# Altium schematic sheet Power-Supplies.SchDoc: Payload Card 5V Rail Power Supplies
size A2; Revision: 1A; SheetNumber: 1; SheetTotal: 3; Organization: Brickworks; Address1: Matthew Glazer; Address2: Design Engineer
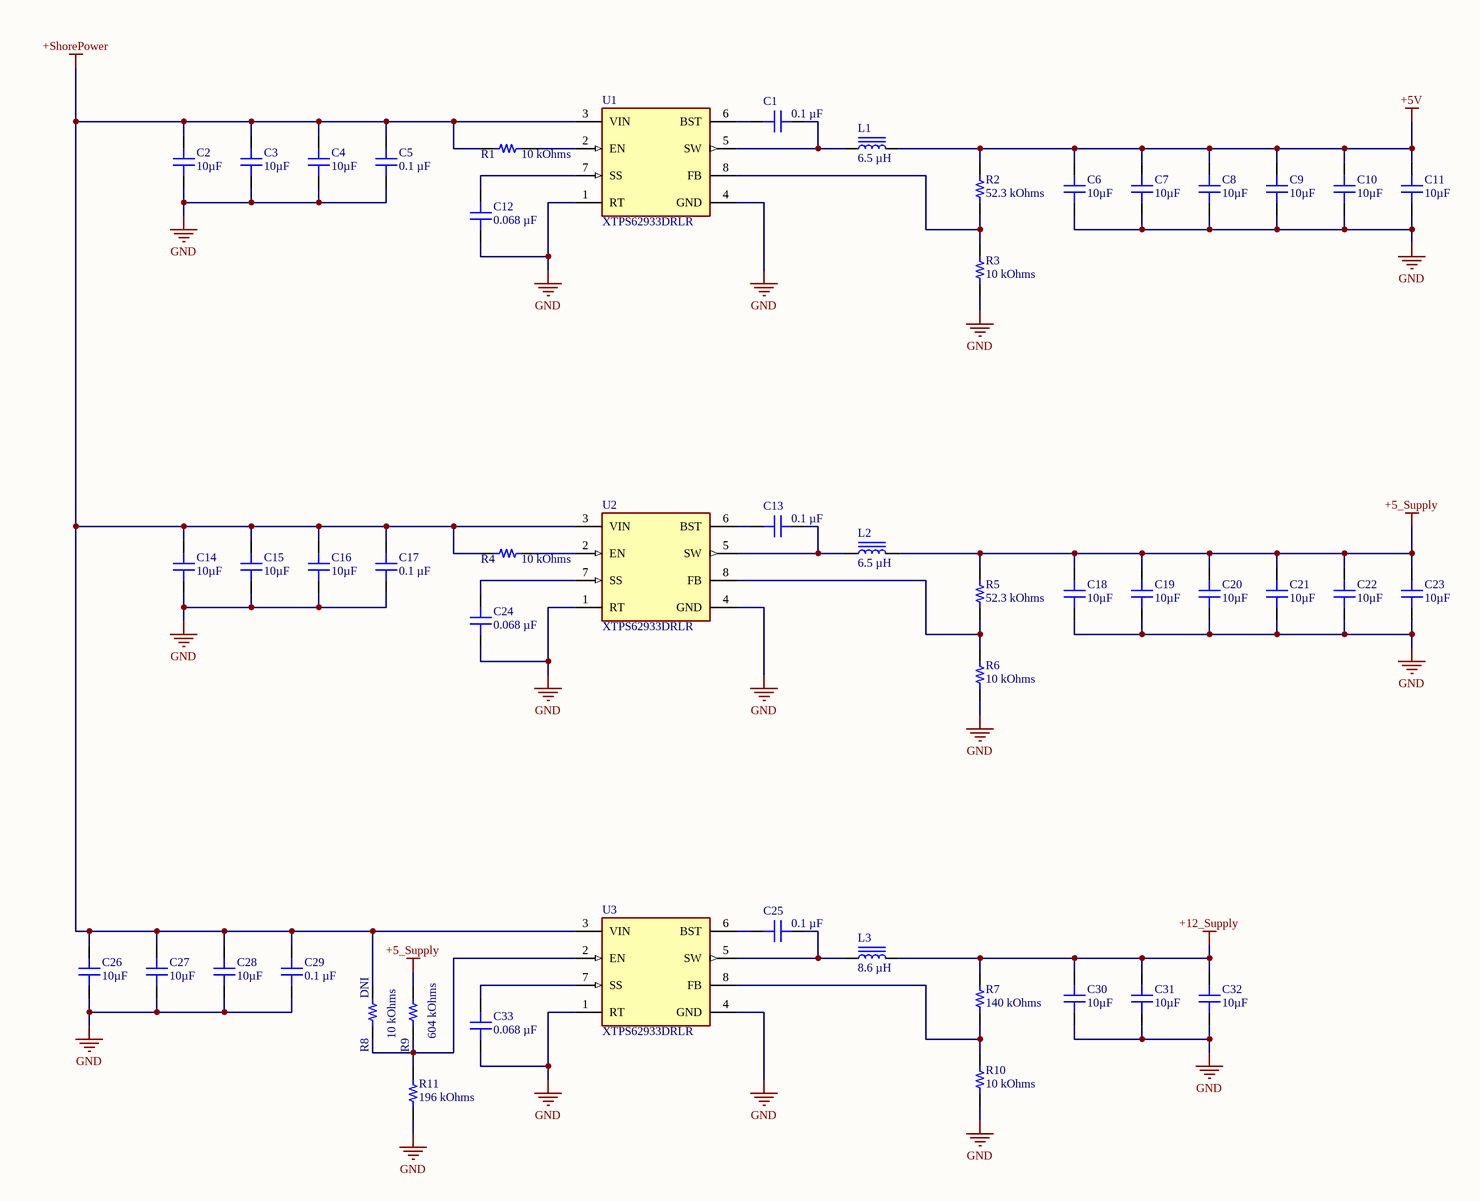
[diagram p0: Power-Supplies.SchDoc]

## Parts
C1  0.1 µF  [CAP 0603_1608]
C2  10µF  [CAP 0805_2012]
C3  10µF  [CAP 0805_2012]
C4  10µF  [CAP 0805_2012]
C5  0.1 µF  [CAP 0603_1608]
C6  10µF  [CAP 0805_2012]
C7  10µF  [CAP 0805_2012]
C8  10µF  [CAP 0805_2012]
C9  10µF  [CAP 0805_2012]
C10  10µF  [CAP 0805_2012]
C11  10µF  [CAP 0805_2012]
C12  0.068 µF  [CAP 0603_1608]
C13  0.1 µF  [CAP 0603_1608]
C14  10µF  [CAP 0805_2012]
C15  10µF  [CAP 0805_2012]
C16  10µF  [CAP 0805_2012]
C17  0.1 µF  [CAP 0603_1608]
C18  10µF  [CAP 0805_2012]
C19  10µF  [CAP 0805_2012]
C20  10µF  [CAP 0805_2012]
C21  10µF  [CAP 0805_2012]
C22  10µF  [CAP 0805_2012]
C23  10µF  [CAP 0805_2012]
C24  0.068 µF  [CAP 0603_1608]
C25  0.1 µF  [CAP 0603_1608]
C26  10µF  [CAP 0805_2012]
C27  10µF  [CAP 0805_2012]
C28  10µF  [CAP 0805_2012]
C29  0.1 µF  [CAP 0603_1608]
C30  10µF  [CAP 0805_2012]
C31  10µF  [CAP 0805_2012]
C32  10µF  [CAP 0805_2012]
C33  0.068 µF  [CAP 0603_1608]
L1  6.5 µH  [TAIYO YUDEN NR1005]
L2  6.5 µH  [TAIYO YUDEN NR1005]
L3  8.6 µH  [BOURNS SRR6028]
R1  10 kOhms  [RES 0603_1608]
R2  52.3 kOhms  [RES 0603_1608]
R3  10 kOhms  [RES 0603_1608]
R4  10 kOhms  [RES 0603_1608]
R5  52.3 kOhms  [RES 0603_1608]
R6  10 kOhms  [RES 0603_1608]
R7  140 kOhms  [RES 0603_1608]
R8  10 kOhms  [RES 0603_1608]
R9  604 kOhms  [RES 0603_1608]
R10  10 kOhms  [RES 0603_1608]
R11  196 kOhms  [RES 0603_1608]
U1  XTPS62933DRLR  [FP-DRL0008A-MFG]
U2  XTPS62933DRLR  [FP-DRL0008A-MFG]
U3  XTPS62933DRLR  [FP-DRL0008A-MFG]

## Nets
+5_Supply: C18.2 C19.2 C20.2 C21.2 C22.2 C23.2 L2.2 R5.2 R9.2
+5V: C6.2 C7.2 C8.2 C9.2 C10.2 C11.2 L1.2 R2.2
+12_Supply: C30.2 C31.2 C32.2 L3.2 R7.2
+ShorePower: C2.2 C3.2 C4.2 C5.1 C14.2 C15.2 C16.2 C17.1 C26.2 C27.2 C28.2 C29.1 R1.1 R4.1 R8.2 U1.3(VIN) U2.3(VIN) U3.3(VIN)
GND: C2.1 C3.1 C4.1 C5.2 C6.1 C7.1 C8.1 C9.1 C10.1 C11.1 C12.1 C14.1 C15.1 C16.1 C17.2 C18.1 C19.1 C20.1 C21.1 C22.1 C23.1 C24.1 C26.1 C27.1 C28.1 C29.2 C30.1 C31.1 C32.1 C33.1 R3.1 R6.1 R10.1 R11.1 U1.1(RT) U1.4(GND) U2.1(RT) U2.4(GND) U3.1(RT) U3.4(GND)
NetC1_1: C1.1 L1.1 U1.5(SW)
NetC1_2: C1.2 U1.6(BST)
NetC12_2: C12.2 U1.7(SS)
NetC13_1: C13.1 L2.1 U2.5(SW)
NetC13_2: C13.2 U2.6(BST)
NetC24_2: C24.2 U2.7(SS)
NetC25_1: C25.1 L3.1 U3.5(SW)
NetC25_2: C25.2 U3.6(BST)
NetC33_2: C33.2 U3.7(SS)
NetR1_2: R1.2 U1.2(EN)
NetR2_1: R2.1 R3.2 U1.8(FB)
NetR4_2: R4.2 U2.2(EN)
NetR5_1: R5.1 R6.2 U2.8(FB)
NetR7_1: R7.1 R10.2 U3.8(FB)
NetR8_1: R8.1 R9.1 R11.2 U3.2(EN)

## Notes on the sheet
- (near R8) DNI
- Title
- Size:
- Date:
- File:
- A2
- Number:
- Time:
- Revision:
- Sheet
- of

## Library data of the parts
C1 C5 C13 C17 C25 C29 = CL10B104KB8NNWC: CAP CER 0.1UF 50V X7R 0603; manufacturer: Samsung Electro-Mechanics; Tolerance: ±10%; Part Number: CL10B104KB8NNWC; Value: 0.1 µF; Applications: General Purpose; Capacitance: 0.1 µF; componentlink1description: Datasheet; componentlink1url: http://www.samsungsem.com/kr/support/product-search/mlcc/CL10B104KB8NNWC.jsp; componentlink2description: DigiKey Link; componentlink2url: https://www.digikey.com/en/products/detail/samsung-electro-mechanics/CL10B104KB8NNWC/3887593; Device Package: 0603 (1608 Metric); lastupdated: 3/8/2022 9:16:52 PM; Lifecycle Status: Active; Minimum Order: 1; Mounting Type: Surface Mount, MLCC; Operating Temperature: -55°C ~ 125°C; Package / Case: 0603 (1608 Metric); packaging: CutTape; partid: 16078; Part Status: Active; price: 0.01; series: CL; Size / Dimension: 0.063" L x 0.031" W (1.60mm x 0.80mm); Supplier 1: DigiKey; Supplier Part Number 1: 1276-1935-1-ND; Temperature Coefficient: X7R; Thickness (Max): 0.035" (0.90mm); Voltage - Rated: 50V
C2-C4 C6-C11 C14-C16 C18-C23 C26-C28 C30-C32 = CC0805KKX5R7BB106: CAP CER 10UF 16V X5R 0805; Manufacturer: Yageo; Tolerance: ±10%; Part Number: CC0805KKX5R7BB106; Value: 10µF; Applications: General Purpose; Capacitance: 10µF; ComponentLink1Description: Datasheet; ComponentLink1URL: https://www.yageo.com/upload/media/product/productsearch/datasheet/mlcc/UPY-GPHC_X5R_4V-to-50V_25.pdf; ComponentLink2Description: DigiKey Link; ComponentLink2URL: http://digikey.com/product-detail/en/yageo/CC0805KKX5R7BB106/311-1865-1-ND/5195767; Device Package: 0805 (2012 Metric); LastUpdated: 9/2/2020 1:04:30 AM; Lifecycle Status: Active; Minimum Order: 1; Mounting Type: Surface Mount, MLCC; Operating Temperature: -55°C ~ 85°C; Package / Case: 0805 (2012 Metric); Packaging: TapeAndReel; PartId: 8867; Part Status: Active; Price: 0.09; Series: CC; Size / Dimension: 0.079" L x 0.049" W (2.00mm x 1.25mm); Supplier 1: DigiKey; Supplier Part Number 1: 311-1865-1-ND; Temperature Coefficient: X5R; Thickness (Max): 0.057" (1.45mm); Voltage - Rated: 16V
C12 C24 C33 = CC0603KRX7R8BB683: CAP CER 0.068UF 25V X7R 0603; manufacturer: Yageo; Tolerance: ±10%; Part Number: CC0603KRX7R8BB683; Value: 0.068 µF; Applications: General Purpose; Capacitance: 0.068 µF; componentlink1description: Datasheet; componentlink1url: https://www.yageo.com/upload/media/product/productsearch/datasheet/mlcc/UPY-GPHC_X7R_6.3V-to-50V_18.pdf; componentlink2description: DigiKey Link; componentlink2url: https://www.digikey.com/en/products/detail/yageo/CC0603KRX7R8BB683/5883792; Device Package: 0603 (1608 Metric); lastupdated: 3/17/2022 8:26:41 AM; Lifecycle Status: Active; Minimum Order: 1; Mounting Type: Surface Mount, MLCC; Operating Temperature: -55°C ~ 125°C; Package / Case: 0603 (1608 Metric); packaging: TapeAndReel; partid: 13821; Part Status: Active; price: 0.01; series: CC; Size / Dimension: 0.063" L x 0.031" W (1.60mm x 0.80mm); Supplier 1: DigiKey; Supplier Part Number 1: 311-4091-1-ND; Temperature Coefficient: X7R; Thickness (Max): 0.035" (0.90mm); Voltage - Rated: 25V
L1 L2 = NR10050T6R5N: FIXED IND 6.5UH 5.2A 23.4MOHM SM; Manufacturer: Taiyo Yuden; Current - Saturation: 6A; DC Resistance (DCR): 23.4mOhm Max; Frequency - Self Resonant: 19MHz; Inductance Frequency - Test: 100 kHz; Material - Core: Ferrite; Shielding: Shielded; Tolerance: ±30%; Type: Wirewound; Part Number: NR10050T6R5N; ComponentLink1Description: Datasheet; ComponentLink1URL: https://ds.yuden.co.jp/TYCOMPAS/ut/detail?pn=NR10050T6R5N  &u=M; ComponentLink2Description: DigiKey Link; ComponentLink2URL: https://www.digikey.com/en/products/detail/taiyo-yuden/NR10050T6R5N/1007971; Current Rating (Amps): 5.2 A; Device Package: Nonstandard; Height - Seated (Max): 0.197" (5.00mm); Inductance: 6.5 µH; LastUpdated: 3/17/2022 9:14:25 AM; Lifecycle Status: Active; Minimum Order: 1; Mounting Type: Surface Mount; Operating Temperature: -25°C ~ 105°C; Package / Case: Nonstandard; Packaging: TapeAndReel; PartId: 3626; Part Status: Active; Price: 0.51; Series: NR; Size / Dimension: 0.394" L x 0.386" W (10.00mm x 9.80mm); Supplier 1: DigiKey; Supplier Part Number 1: 587-1697-1-ND; Value: 6.5 µH
L3 = SRR6028-8R6Y: FIXED IND 8.6UH 2.1A 56 MOHM SMD; Manufacturer: Bourns Inc.; Current - Saturation: 1.82A; DC Resistance (DCR): 56mOhm Max; Frequency - Self Resonant: 28MHz; Inductance Frequency - Test: 100 kHz; Material - Core: Ferrite; Q @ Freq: 8 @ 2.52MHz; Shielding: Shielded; Tolerance: ±30%; Type: Wirewound; Part Number: SRR6028-8R6Y; ComponentLink1Description: Datasheet; ComponentLink1URL: https://www.bourns.com/docs/Product-Datasheets/SRR6028.pdf; ComponentLink2Description: DigiKey Link; ComponentLink2URL: https://www.digikey.com/en/products/detail/bourns-inc/SRR6028-8R6Y/1970374; Current Rating (Amps): 2.1 A; Device Package: Nonstandard; Height - Seated (Max): 0.118" (3.00mm); Inductance: 8.6 µH; LastUpdated: 3/17/2022 9:03:42 AM; Lifecycle Status: Active; Minimum Order: 1; Mounting Type: Surface Mount; Operating Temperature: -40°C ~ 125°C; Package / Case: Nonstandard; Packaging: TapeAndReel; PartId: 46; Part Status: Active; Price: 0.45; Series: SRR6028; Size / Dimension: 0.268" L x 0.268" W (6.80mm x 6.80mm); Supplier 1: DigiKey; Supplier Part Number 1: SRR6028-8R6YCT-ND; Value: 8.6 µH
R1 R3 R4 R6 R8 R10 = RMCF0603JT10K0: RES 10K OHM 5% 1/10W 0603; Manufacturer: Stackpole Electronics Inc; Power (Watts): 0.1W, 1/10W; Temperature Coefficient: ±200ppm/°C; Part Number: RMCF0603JT10K0; Value: 10 kOhms; ComponentLink1Description: Datasheet; ComponentLink1URL: https://www.seielect.com/catalog/sei-packaging.pdf; ComponentLink2Description: DigiKey Link; ComponentLink2URL: http://digikey.com/product-detail/en/stackpole-electronics-inc/RMCF0603JT10K0/RMCF0603JT10K0CT-ND/1943191; Composition: Thick Film; Device Package: 0603 (1608 Metric); Features: Automotive AEC-Q200; Height - Seated (Max): 0.022" (0.55mm); LastUpdated: 8/30/2020 8:48:45 PM; Lifecycle Status: Active; Minimum Order: 1; Number of Terminations: 2; Operating Temperature: -55°C ~ 155°C; Package / Case: 0603 (1608 Metric); Packaging: CutTape; PartId: 25659; Part Status: Active; Price: 0.10; Ratings: AEC-Q200; Resistance: 10 kOhms; Series: RMCF; Size / Dimension: 0.061" L x 0.031" W (1.55mm x 0.80mm); Supplier 1: DigiKey; Supplier Part Number 1: RMCF0603JT10K0CT-ND; Supplier Device Package: 0603; Tolerance: ±5%
R2 R5 = RMCF0603FT52K3: RES 52.3K OHM 1% 1/10W 0603; Manufacturer: Stackpole Electronics Inc; Power (Watts): 0.1W, 1/10W; Temperature Coefficient: ±100ppm/°C; Part Number: RMCF0603FT52K3; Value: 52.3 kOhms; ComponentLink1Description: Datasheet; ComponentLink1URL: https://www.seielect.com/catalog/sei-rmcf_rmcp.pdf; ComponentLink2Description: DigiKey Link; ComponentLink2URL: https://www.digikey.com/en/products/detail/stackpole-electronics-inc/RMCF0603FT52K3/1714113; Composition: Thick Film; Device Package: 0603 (1608 Metric); Features: Automotive AEC-Q200; Height - Seated (Max): 0.022" (0.55mm); LastUpdated: 3/17/2022 8:41:15 AM; Lifecycle Status: Active; Minimum Order: 1; Number of Terminations: 2; Operating Temperature: -55°C ~ 155°C; Package / Case: 0603 (1608 Metric); Packaging: CutTape; PartId: 26555; Part Status: Active; Price: 0.01; Ratings: AEC-Q200; Resistance: 52.3 kOhms; Series: RMCF; Size / Dimension: 0.061" L x 0.031" W (1.55mm x 0.80mm); Supplier 1: DigiKey; Supplier Part Number 1: RMCF0603FT52K3CT-ND; Supplier Device Package: 0603; Tolerance: ±1%
R7 = RMCF0603FT140K: RES 140K OHM 1% 1/10W 0603; Manufacturer: Stackpole Electronics Inc; Power (Watts): 0.1W, 1/10W; Temperature Coefficient: ±100ppm/°C; Part Number: RMCF0603FT140K; Value: 140 kOhms; ComponentLink1Description: Datasheet; ComponentLink1URL: https://www.seielect.com/catalog/sei-packaging.pdf; ComponentLink2Description: DigiKey Link; ComponentLink2URL: https://www.digikey.com/en/products/detail/stackpole-electronics-inc/RMCF0603FT140K/1761303; Composition: Thick Film; Device Package: 0603 (1608 Metric); Features: Automotive AEC-Q200; Height - Seated (Max): 0.022" (0.55mm); LastUpdated: 3/17/2022 8:42:10 AM; Lifecycle Status: Active; Minimum Order: 1; Number of Terminations: 2; Operating Temperature: -55°C ~ 155°C; Package / Case: 0603 (1608 Metric); Packaging: CutTape; PartId: 10763; Part Status: Active; Price: 0.01; Ratings: AEC-Q200; Resistance: 140 kOhms; Series: RMCF; Size / Dimension: 0.061" L x 0.031" W (1.55mm x 0.80mm); Supplier 1: DigiKey; Supplier Part Number 1: RMCF0603FT140KCT-ND; Supplier Device Package: 0603; Tolerance: ±1%
R9 = RMCF0603FT604K: RES 604K OHM 1% 1/10W 0603; Manufacturer: Stackpole Electronics Inc; Power (Watts): 0.1W, 1/10W; Temperature Coefficient: ±100ppm/°C; Part Number: RMCF0603FT604K; Value: 604 kOhms; ComponentLink1Description: Datasheet; ComponentLink1URL: https://www.seielect.com/catalog/sei-packaging.pdf; ComponentLink2Description: DigiKey Link; ComponentLink2URL: https://www.digikey.com/en/products/detail/stackpole-electronics-inc/RMCF0603FT604K/1714165; Composition: Thick Film; Device Package: 0603 (1608 Metric); Features: Automotive AEC-Q200; Height - Seated (Max): 0.022" (0.55mm); LastUpdated: 3/17/2022 8:41:50 AM; Lifecycle Status: Active; Minimum Order: 1; Number of Terminations: 2; Operating Temperature: -55°C ~ 155°C; Package / Case: 0603 (1608 Metric); Packaging: CutTape; PartId: 18486; Part Status: Active; Price: 0.01; Ratings: AEC-Q200; Resistance: 604 kOhms; Series: RMCF; Size / Dimension: 0.061" L x 0.031" W (1.55mm x 0.80mm); Supplier 1: DigiKey; Supplier Part Number 1: RMCF0603FT604KCT-ND; Supplier Device Package: 0603; Tolerance: ±1%
R11 = RMCF0603FT196K: RES 196K OHM 1% 1/10W 0603; Manufacturer: Stackpole Electronics Inc; Power (Watts): 0.1W, 1/10W; Temperature Coefficient: ±100ppm/°C; Part Number: RMCF0603FT196K; Value: 196 kOhms; ComponentLink1Description: Datasheet; ComponentLink1URL: https://www.seielect.com/catalog/sei-rmcf_rmcp.pdf; ComponentLink2Description: DigiKey Link; ComponentLink2URL: https://www.digikey.com/en/products/detail/stackpole-electronics-inc/RMCF0603FT196K/1761087; Composition: Thick Film; Device Package: 0603 (1608 Metric); Features: Automotive AEC-Q200; Height - Seated (Max): 0.022" (0.55mm); LastUpdated: 3/17/2022 8:42:07 AM; Lifecycle Status: Active; Minimum Order: 1; Number of Terminations: 2; Operating Temperature: -55°C ~ 155°C; Package / Case: 0603 (1608 Metric); Packaging: CutTape; PartId: 11666; Part Status: Active; Price: 0.01; Ratings: AEC-Q200; Resistance: 196 kOhms; Series: RMCF; Size / Dimension: 0.061" L x 0.031" W (1.55mm x 0.80mm); Supplier 1: DigiKey; Supplier Part Number 1: RMCF0603FT196KCT-ND; Supplier Device Package: 0603; Tolerance: ±1%
U1-U3 = CMP-04918-000610-1: 3.8-V to 30-V, 3-A, 200-kHz to 2.2-MHz, low-IQ synchronous buck converter in SOT-583 package 8-SOT-5X3 -40 to 150